# Altium schematic sheet Sheet1.SchDoc
size A2; PageSetup: Record=PageOptions|CenterHorizontal=True|CenterVertical=True|PrintScale=4.35|XCorrection=1.00|YCorrection=1.00|PrintKind=1|BorderSize=5000000|LeftOffset=0|BottomOffset=0|Orientation=2|PaperLength=1000|PaperWidth=1000|Scale=100|PaperSource=7|PrintQuality=-3|MediaType=1|DitherType=10|PrintScaleMode=1|PaperKind=A0|PaperIndex=139
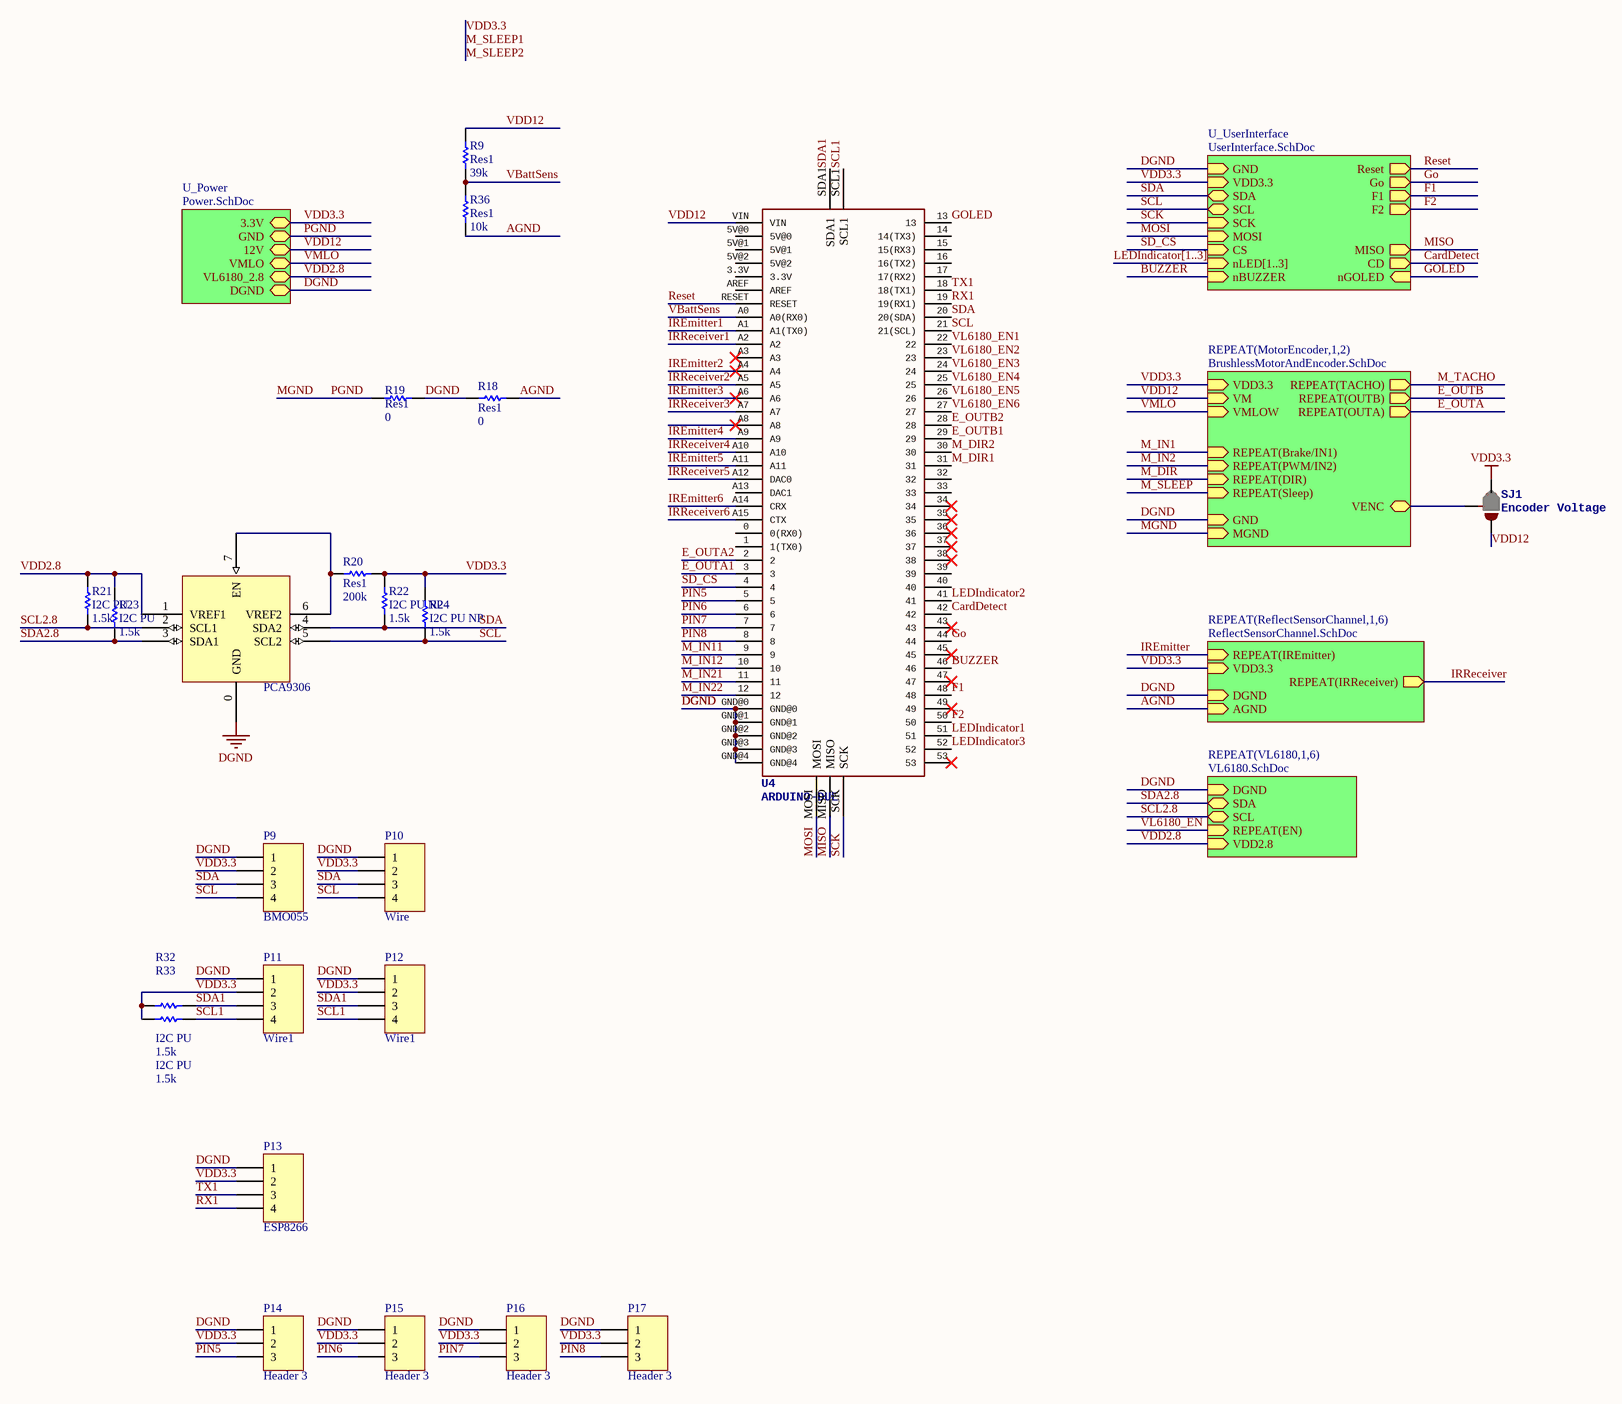
[diagram p0: Sheet1.SchDoc]

## Parts
P9  BMO055  [PH_4_PTH]
P10  Wire  [PH_4_PTH]
P11  Wire1  [PH_4_PTH]
P12  Wire1  [PH_4_PTH]
P13  ESP8266  [PH_4_PTH]
P14  Header 3  [HDR1X3]
P15  Header 3  [HDR1X3]
P16  Header 3  [HDR1X3]
P17  Header 3  [HDR1X3]
PCA1  PCA9306  [SOIC_E200_8]
R9  Res1  value 39k  [RES_0805]
R18  Res1  value 0  [RES_0805]
R19  Res1  value 0  [RES_0805]
R20  Res1  value 200k  [RES_0805]
R21  I2C PU  value 1.5k  [RES_0805]
R22  I2C PU NP  value 1.5k  [RES_0805]
R23  I2C PU  value 1.5k  [RES_0805]
R24  I2C PU NP  value 1.5k  [RES_0805]
R32  I2C PU  value 1.5k  [RES_0805]
R33  I2C PU  value 1.5k  [RES_0805]
R36  Res1  value 10k  [RES_0805]
SJ1  Encoder Voltage  [PAD-JUMPER-3-2OF3_NC_BY_PASTE_YES_SILK_FULL_BOX]
U4  ARDUINO-DUE  [ARDUINO_DUE]

## Sub-sheets
REPEAT(MotorEncoder,1,2) = BrushlessMotorAndEncoder.SchDoc: VM, MGND, REPEAT(Brake/IN1) (in), REPEAT(PWM/IN2) (in), REPEAT(DIR) (in), REPEAT(TACHO) (out), GND, REPEAT(OUTB) (out), REPEAT(OUTA) (out), VDD3.3, REPEAT(Sleep) (in), VMLOW, VENC
REPEAT(ReflectSensorChannel,1,6) = ReflectSensorChannel.SchDoc: REPEAT(IREmitter) (in), REPEAT(IRReceiver) (out), VDD3.3, DGND, AGND
REPEAT(VL6180,1,6) = VL6180.SchDoc: DGND, SDA (bidir), SCL (bidir), REPEAT(EN) (in), VDD2.8
U_Power = Power.SchDoc: 3.3V, GND, 12V, VMLO, VL6180_2.8, DGND
U_UserInterface = UserInterface.SchDoc: GND, VDD3.3, SDA (bidir), SCL (bidir), Reset (out), Go (out), F1 (out), F2 (out), SCK (in), MISO (out), MOSI (in), CS (in), CD (out), nLED[1..3] (in), nBUZZER (in), nGOLED (in)

## Nets
DGND: P9.1 P10.1 P11.1 P12.1 P13.1 P14.1 P15.1 P16.1 P17.1 PCA1.0(GND) R18.1 R19.2 U4.GND@0 U4.GND@1 U4.GND@2 U4.GND@3 U4.GND@4 ; sheet REPEAT(ReflectSensorChannel,1,6)/DGND, sheet U_UserInterface/GND, sheet U_Power/DGND, sheet REPEAT(MotorEncoder,1,2)/GND, sheet REPEAT(VL6180,1,6)/DGND
M_SLEEP1: P9.2 P10.2 P11.2 P12.2 P13.2 P14.2 P15.2 P16.2 P17.2 R20.2 R22.2 R24.2 R32.1 R33.1 SJ1.3 ; sheet REPEAT(ReflectSensorChannel,1,6)/VDD3.3, sheet U_UserInterface/VDD3.3, sheet U_Power/3.3V, sheet REPEAT(MotorEncoder,1,2)/VDD3.3  [also labelled M_SLEEP2, VDD3.3]
AGND: R18.2 R36.1 ; sheet REPEAT(ReflectSensorChannel,1,6)/AGND
BUZZER: U4.46 ; sheet U_UserInterface/nBUZZER
CardDetect: U4.42 ; sheet U_UserInterface/CD
E_OUTA: sheet REPEAT(MotorEncoder,1,2)/REPEAT(OUTA)
E_OUTA1: U4.3
E_OUTA2: U4.2
E_OUTB: sheet REPEAT(MotorEncoder,1,2)/REPEAT(OUTB)
E_OUTB1: U4.29
E_OUTB2: U4.28
F1: U4.48 ; sheet U_UserInterface/F1
F2: U4.50 ; sheet U_UserInterface/F2
Go: U4.44 ; sheet U_UserInterface/Go
GOLED: U4.13 ; sheet U_UserInterface/nGOLED
IREmitter: sheet REPEAT(ReflectSensorChannel,1,6)/REPEAT(IREmitter)
IREmitter1: U4.A1(A1(TX0))
IREmitter2: U4.A4
IREmitter3: U4.A6
IREmitter4: U4.A9
IREmitter5: U4.A11
IREmitter6: U4.A14(CRX)
IRReceiver: sheet REPEAT(ReflectSensorChannel,1,6)/REPEAT(IRReceiver)
IRReceiver1: U4.A2
IRReceiver2: U4.A5
IRReceiver3: U4.A7
IRReceiver4: U4.A10
IRReceiver5: U4.A12(DAC0)
IRReceiver6: U4.A15(CTX)
LEDIndicator1: U4.51
LEDIndicator2: U4.41
LEDIndicator3: U4.52
M_DIR: sheet REPEAT(MotorEncoder,1,2)/REPEAT(DIR)
M_DIR1: U4.31
M_DIR2: U4.30
M_IN1: sheet REPEAT(MotorEncoder,1,2)/REPEAT(Brake/IN1)
M_IN2: sheet REPEAT(MotorEncoder,1,2)/REPEAT(PWM/IN2)
M_IN11: U4.9
M_IN12: U4.10
M_IN21: U4.11
M_IN22: U4.12
M_SLEEP: sheet REPEAT(MotorEncoder,1,2)/REPEAT(Sleep)
M_TACHO: sheet REPEAT(MotorEncoder,1,2)/REPEAT(TACHO)
MGND: R19.1 ; sheet U_Power/GND, sheet REPEAT(MotorEncoder,1,2)/MGND  [also labelled PGND]
MISO: U4.MISO ; sheet U_UserInterface/MISO
MOSI: U4.MOSI ; sheet U_UserInterface/MOSI
PIN5: P14.3 U4.5
PIN6: P15.3 U4.6
PIN7: P16.3 U4.7
PIN8: P17.3 U4.8
Reset: U4.RESET ; sheet U_UserInterface/Reset
RX1: P13.4 U4.19(19(RX1))
SCK: U4.SCK ; sheet U_UserInterface/SCK
SCL: P9.4 P10.4 PCA1.5(SCL2) R24.1 U4.21(21(SCL)) ; sheet U_UserInterface/SCL
SCL1: P11.4 P12.4 R33.2 U4.SCL1
SCL2.8: PCA1.2(SCL1) R21.1 ; sheet REPEAT(VL6180,1,6)/SCL
SD_CS: U4.4 ; sheet U_UserInterface/CS
SDA: P9.3 P10.3 PCA1.4(SDA2) R22.1 U4.20(20(SDA)) ; sheet U_UserInterface/SDA
SDA1: P11.3 P12.3 R32.2 U4.SDA1
SDA2.8: PCA1.3(SDA1) R23.1 ; sheet REPEAT(VL6180,1,6)/SDA
TX1: P13.3 U4.18(18(TX1))
VBattSens: R9.1 R36.2 U4.A0(A0(RX0))
VDD2.8: PCA1.1(VREF1) R21.2 R23.2 ; sheet U_Power/VL6180_2.8, sheet REPEAT(VL6180,1,6)/VDD2.8
VDD12: R9.2 SJ1.1 U4.VIN ; sheet U_Power/12V, sheet REPEAT(MotorEncoder,1,2)/VM
VL6180_EN: sheet REPEAT(VL6180,1,6)/REPEAT(EN)
VL6180_EN1: U4.22
VL6180_EN2: U4.23
VL6180_EN3: U4.24
VL6180_EN4: U4.25
VL6180_EN5: U4.26
VL6180_EN6: U4.27
VMLO: sheet U_Power/VMLO, sheet REPEAT(MotorEncoder,1,2)/VMLOW
NetPCA1_6: PCA1.6(VREF2) PCA1.7(EN) R20.1
NetSJ1_2: SJ1.2 ; sheet REPEAT(MotorEncoder,1,2)/VENC

Not connected (* = marked no-connect by the designer): U4 0(0(RX0)) 1(1(TX0)) 3.3V 5V@0 5V@1 5V@2 14(14(TX3)) 15(15(RX3)) 16(16(TX2)) 17(17(RX2)) 32 33 34* 35* 36* 37* 38* 39 40 43* 45* 47* 49* 53* A3* A8* A13(DAC1) AREF

## Buses and harness runs
bus LEDIndicator[1..3] = sheet U_UserInterface/nLED[1..3]

## Library data of the parts
P9-P13 = Header 4: Header, 4-Pin; LatestRevisionDate: 17-Jul-2002; LatestRevisionNote: Re-released for DXP Platform.; Publisher: Altium Limited
P14-P17 = Header 3: Header, 3-Pin; LatestRevisionDate: 17-Jul-2002; LatestRevisionNote: Re-released for DXP Platform.; Publisher: Altium Limited
PCA1 = Component_1_1: I2C shifting voltage; pin to pad: 0>1 1>2 2>3 3>4 4>5 5>6 6>7 7>8
R9 R18-R24 R32 R33 R36 = Res1: Resistor; Published: 8-Jun-2000; LatestRevisionDate: 17-Jul-2002; LatestRevisionNote: Re-released for DXP Platform.; PackageReference: AXIAL-0.3; Publisher: Altium Limited; PackageDescription: Axial Device, Thru-Hole; 2 Leads; 0.3 in Pin Spacing
SJ1 = JUMPER-PAD-3-2OF3_NC_BY_PASTE